# EAGLE schematic babelbabel (EAGLE 9.6.2)

## Sheet 1 of 2
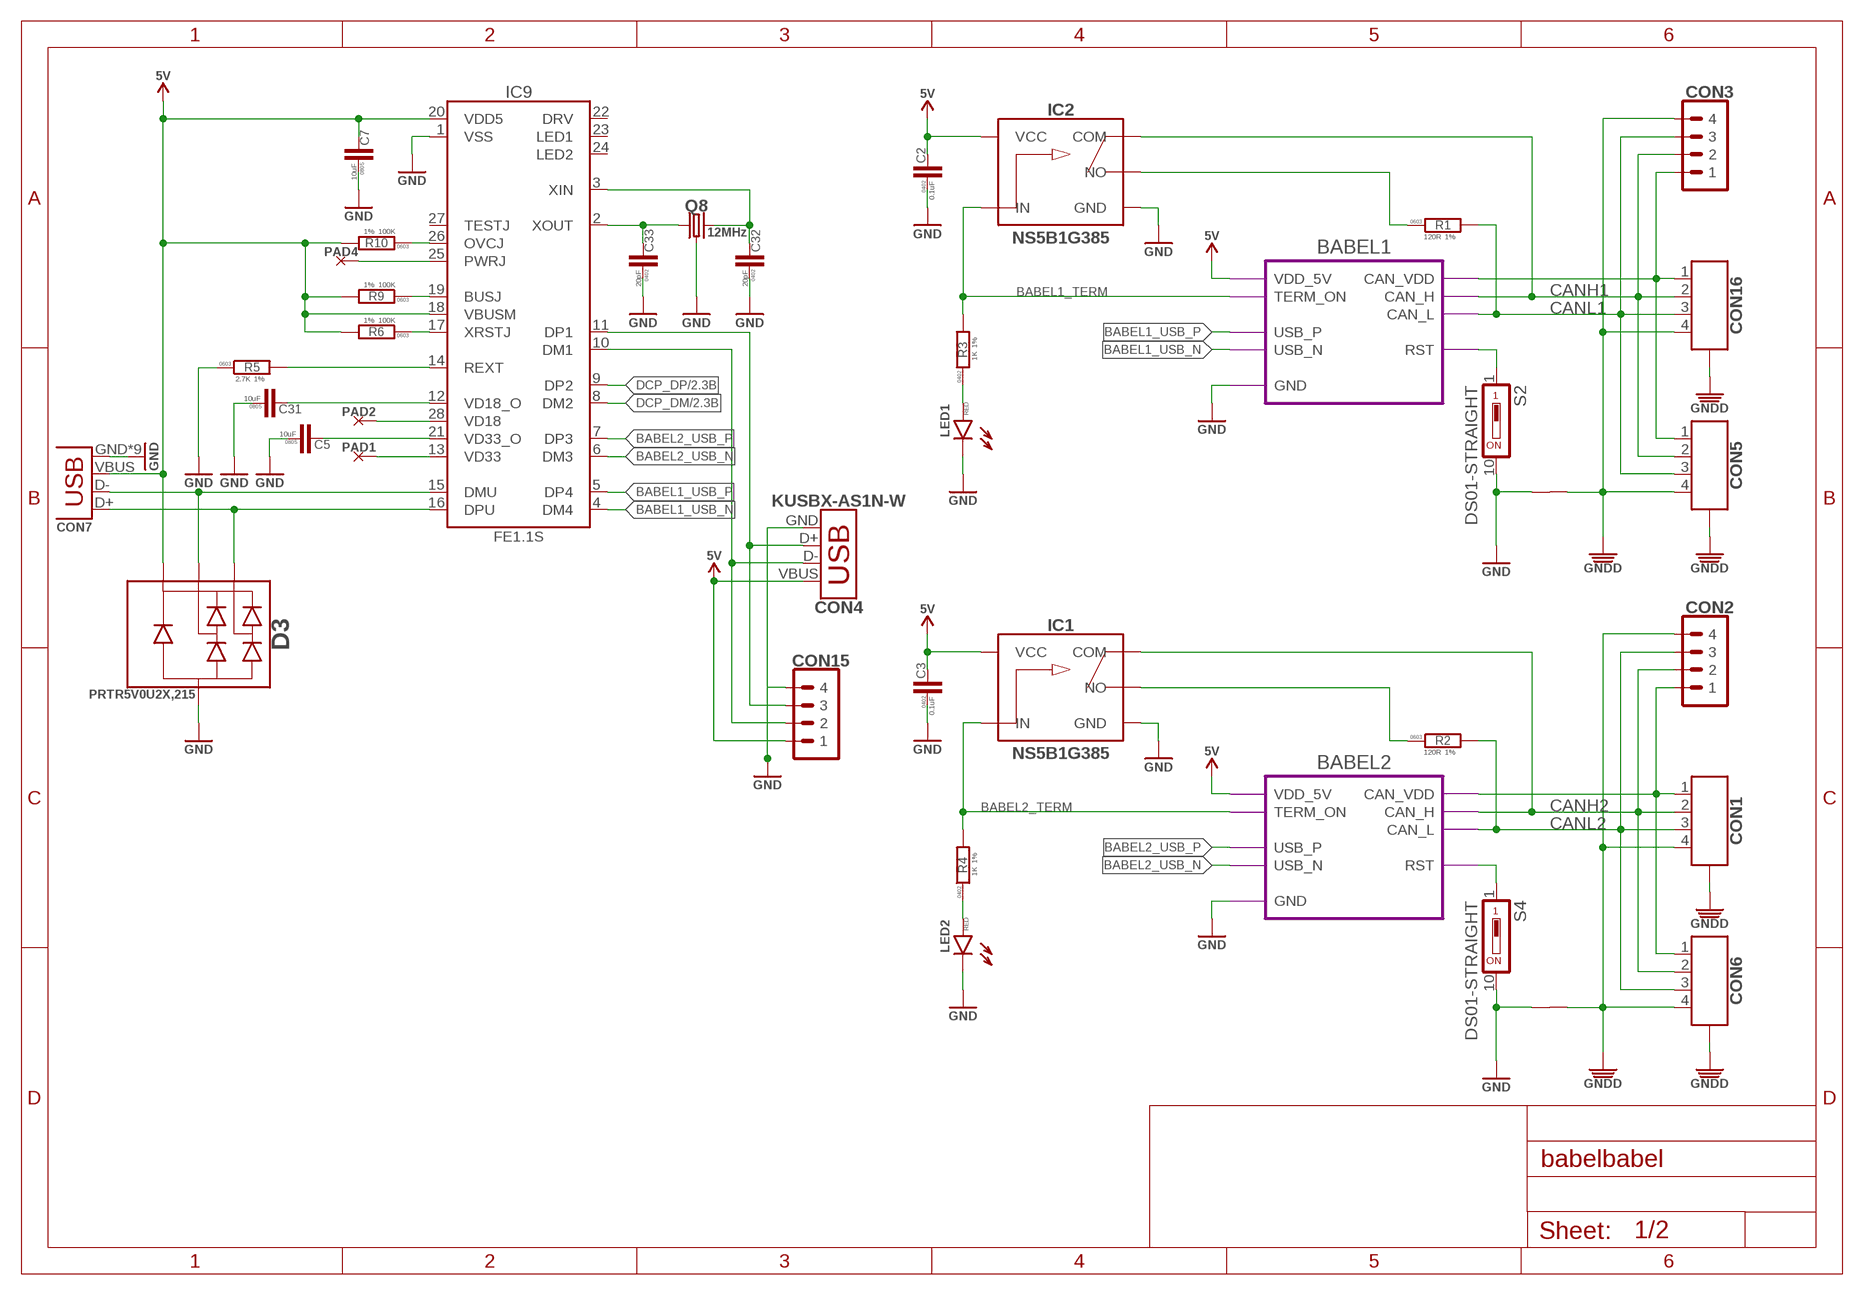
[diagram p0: schematic, sheet 1]

### Parts
C2  0.1uF  C-0402  [C0402]
C3  0.1uF  C-0402  [C0402]
C5  10uF  C-0805  [C0805]
C7  10uF  C-0805  [C0805]
C31  10uF  C-0805  [C0805]
C32  20pF  C-0402  [C0402]
C33  20pF  C-0402  [C0402]
CON1  CON-4P-TABS-JST_GH-RA  [JST_GH-4P-RA]
CON2  PINHEAD_1X04-2.54  [1X04-PTH-2.54]
CON3  PINHEAD_1X04-2.54  [1X04-PTH-2.54]
CON4  USB-AA-PTH  [USB-A-F-PTH]
CON5  CON-4P-TABS-JST_GH-RA  [JST_GH-4P-RA]
CON6  CON-4P-TABS-JST_GH-RA  [JST_GH-4P-RA]
CON7  USB-1  [MICRO_USB_PEGS]
CON15  PINHEAD_1X04-2.54  [1X04-PTH-2.54]
CON16  CON-4P-TABS-JST_GH-RA  [JST_GH-4P-RA]
D3  PRTR5V0U2X  [SOT143B]
IC1  NS5B1G385  [SOT23-5L]
IC2  NS5B1G385  [SOT23-5L]
IC9  FE1.1S  [SSOP-28]
J1  CONNECTION-SMD  [CONNECTION]
J2  CONNECTION-SMD  [CONNECTION]
LED1  LED-0402  [LED0402]
LED2  LED-0402  [LED0402]
PAD1  PAD-S_2X2  [2х2]
PAD2  PAD-S_2X2  [2х2]
PAD4  PAD-S_2X2  [2х2]
Q8  12MHz  CRYSTAL-4P-16MHZ-3.2X2.5  [OSCILLATOR-3.2X2.5-4P]
R1  120R  R-1%-0603  [R0603]
R2  120R  R-1%-0603  [R0603]
R3  1K  R-1%-0402  [R0402]
R4  1K  R-1%-0402  [R0402]
R5  2.7K  R-1%-0603  [R0603]
R6  100K  R-1%-0603  [R0603]
R9  100K  R-1%-0603  [R0603]
R10  100K  R-1%-0603  [R0603]
S2  DS01-STRAIGHT  [DS-01]
S4  DS01-STRAIGHT  [DS-01]

### Module instances
BABEL1 = BABEL (part numbers offset by 100)
BABEL2 = BABEL (part numbers offset by 200)

### Nets
BABEL1_RST: S2.1 ; port BABEL1.RST
BABEL1_RST1: S4.1 ; port BABEL2.RST
BABEL1_TERM: IC2.4(IN) R3.2 ; port BABEL1.TERM_ON
BABEL1_USB_N: IC9.4(DM4) ; port BABEL1.USB_N
BABEL1_USB_P: IC9.5(DP4) ; port BABEL1.USB_P
BABEL2_TERM: IC1.4(IN) R4.2 ; port BABEL2.TERM_ON
BABEL2_USB_N: IC9.6(DM3) ; port BABEL2.USB_N
BABEL2_USB_P: IC9.7(DP3) ; port BABEL2.USB_P
CAN1_VDD: CON3.1 CON5.1 CON16.1 ; port BABEL1.CAN_VDD
CAN1_VDD1: CON1.1 CON2.1 CON6.1 ; port BABEL2.CAN_VDD
CAN_L: IC2.2(NO) R1.1
CANH1: CON3.2 CON5.2 CON16.2 IC2.1(COM) ; port BABEL1.CAN_H
CANH2: CON1.2 CON2.2 CON6.2 IC1.1(COM) ; port BABEL2.CAN_H
CANL1: CON3.3 CON5.3 CON16.3 R1.2 ; port BABEL1.CAN_L
CANL2: CON1.3 CON2.3 CON6.3 R2.2 ; port BABEL2.CAN_L
DCP_DM: IC9.8(DM2) ; also sheet 2
DCP_DP: IC9.9(DP2) ; also sheet 2
DUT_DM: CON4.D- CON15.2 IC9.10(DM1)
DUT_DP: CON4.D+ CON15.3 IC9.11(DP1)
GND: C2.1 C3.1 C5.1 C7.1 C31.1 C32.1 C33.1 CON4.GND CON7.GND CON7.GND1(GND) CON7.GND2(GND) CON7.GND3(GND) CON7.GND4(GND) CON7.P$1(GND) CON7.P$2(GND) CON7.P$3(GND) CON7.P$4(GND) CON15.4 D3.1(C) IC1.3(GND) IC2.3(GND) IC9.1(VSS) J1.P$1 J2.P$1 LED1.C LED2.C Q8.2(GND) Q8.4(GND) R5.1 S2.10 S4.10 ; port BABEL1.GND BABEL2.GND ; also sheet 2
GNDD: CON1.4 CON1.M$0(GND) CON1.M$1(GND) CON2.4 CON3.4 CON5.4 CON5.M$0(GND) CON5.M$1(GND) CON6.4 CON6.M$0(GND) CON6.M$1(GND) CON16.4 CON16.M$0(GND) CON16.M$1(GND) J1.P$2 J2.P$2
N$1: LED1.A R3.1
N$2: IC1.2(NO) R2.1
N$3: LED2.A R4.1
N$9: C31.2 IC9.12(VD18_O)
N$10: IC9.14(REXT) R5.2
N$14: C33.2 IC9.2(XOUT) Q8.1
N$16: C32.2 IC9.3(XIN) Q8.3
N$17: CON7.D+ D3.2(D1) IC9.16(DPU)
N$18: CON7.D- D3.3(D2) IC9.15(DMU)
N$19: IC9.26(OVCJ) R10.1
N$24: C5.2 IC9.21(VD33_O)
N$25: IC9.17(XRSTJ) R6.1
N$26: IC9.19(BUSJ) R9.1
N$27: IC9.25(PWRJ) PAD4.P$1
N$29: IC9.13(VD33) PAD1.P$1
N$30: IC9.28(VD18) PAD2.P$1
VDD_5V: C2.2 C3.2 C7.2 CON4.VBUS CON7.VBUS CON15.1 D3.4(A) IC1.5(VCC) IC2.5(VCC) IC9.18(VBUSM) IC9.20(VDD5) R6.2 R9.2 R10.2 ; port BABEL1.VDD_5V BABEL2.VDD_5V ; supply symbol labelled 5V ; also sheet 2
Unconnected: IC9.22(DRV) IC9.23(LED1) IC9.24(LED2) IC9.27(TESTJ)

## Sheet 2 of 2: DCP
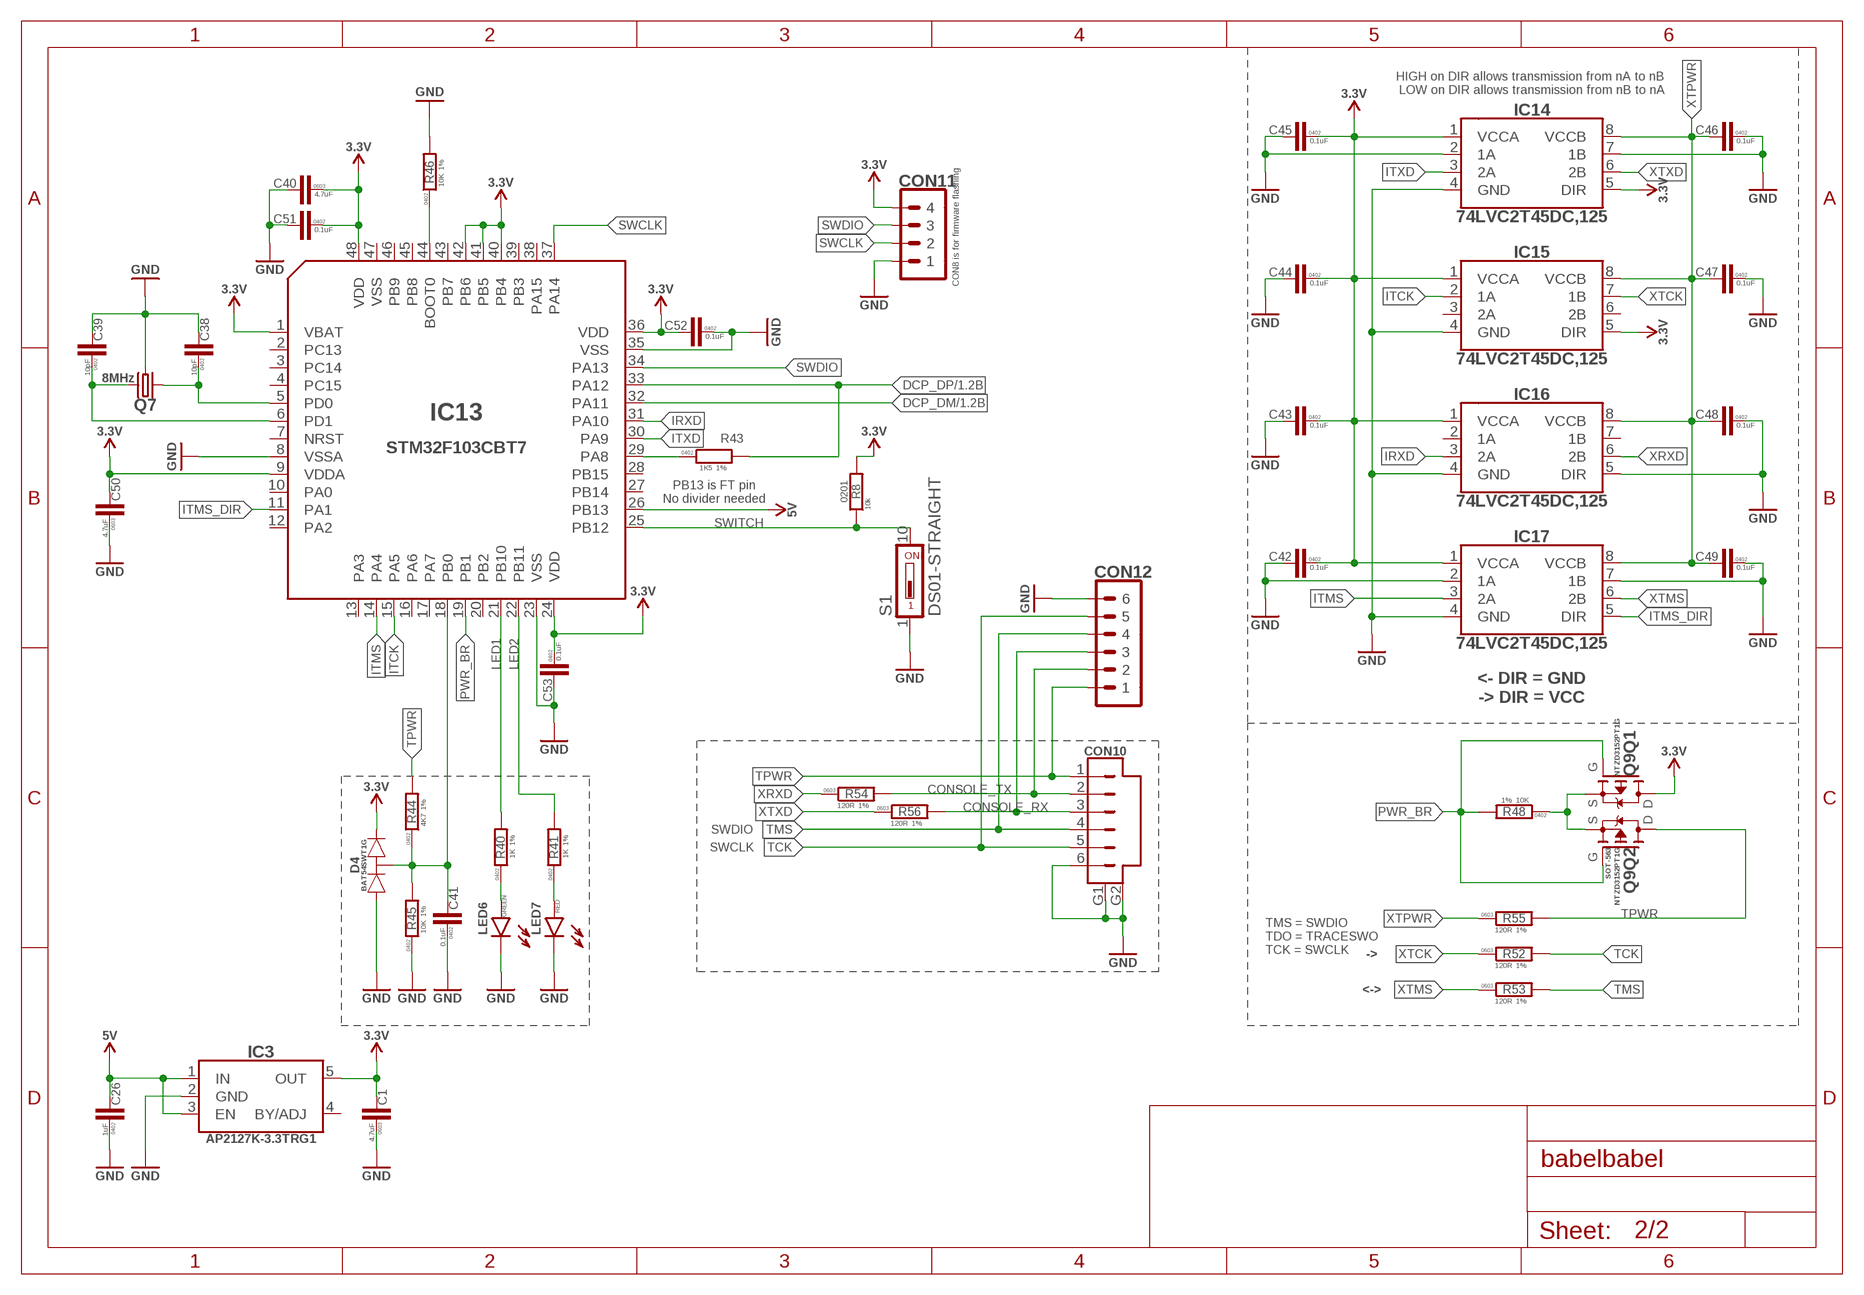
[diagram p1: schematic, sheet 2]

### Parts
C1  4.7uF  C-0603  [C0603]
C26  1uF  C-0402  [C0402]
C38  10pF  C-0402  [C0402]
C39  10pF  C-0402  [C0402]
C40  4.7uF  C-0603  [C0603]
C41  0.1uF  C-0402  [C0402]
C42  0.1uF  C-0402  [C0402]
C43  0.1uF  C-0402  [C0402]
C44  0.1uF  C-0402  [C0402]
C45  0.1uF  C-0402  [C0402]
C46  0.1uF  C-0402  [C0402]
C47  0.1uF  C-0402  [C0402]
C48  0.1uF  C-0402  [C0402]
C49  0.1uF  C-0402  [C0402]
C50  4.7uF  C-0603  [C0603]
C51  0.1uF  C-0402  [C0402]
C52  0.1uF  C-0402  [C0402]
C53  0.1uF  C-0402  [C0402]
CON10  CON-6P-SM06B  [SM06B]
CON11  PINHEAD_1X04-2.54  [1X04-PTH-2.54]
CON12  PINHEAD_1X06-2.54  [1X06-PTH-2.54]
D4  BAT54SWT1G  [SC70]
IC3  AP2127-3.3  [SOT23-5]
IC13  STM32F103CBT7  [LQFP48]
IC14  74LVC2T45  [VSSOP8]
IC15  74LVC2T45  [VSSOP8]
IC16  74LVC2T45  [VSSOP8]
IC17  74LVC2T45  [VSSOP8]
LED6  LED-0402  [LED0402]
LED7  LED-0402  [LED0402]
Q7  8MHz  CRYSTAL-4P-3.2X2.5  [OSCILLATOR-3.2X2.5-4P]
Q9  NTZD3152PT1G  [SOT-563]
R8  10k  R-EU_R0201  [R0201]
R40  1K  R-1%-0402  [R0402]
R41  1K  R-1%-0402  [R0402]
R43  1K5  R-1%-0402  [R0402]
R44  4K7  R-1%-0402  [R0402]
R45  10K  R-1%-0402  [R0402]
R46  10K  R-1%-0402  [R0402]
R48  10K  R-1%-0402  [R0402]
R52  120R  R-1%-0603  [R0603]
R53  120R  R-1%-0603  [R0603]
R54  120R  R-1%-0603  [R0603]
R55  120R  R-1%-0603  [R0603]
R56  120R  R-1%-0603  [R0603]
S1  DS01-STRAIGHT  [DS-01]

### Nets
CONSOLE_RX: CON10.3 CON12.3 R56.2
CONSOLE_TX: CON10.2 CON12.2 R54.2
DCP_DM: IC13.32(PA11) ; also sheet 1
DCP_DP: IC13.33(PA12) R43.2 ; also sheet 1
GND: C1.1 C26.1 C38.2 C39.2 C40.2 C41.1 C42.2 C43.2 C44.2 C45.2 C46.1 C47.1 C48.1 C49.1 C50.1 C51.2 C52.1 C53.2 CON10.6 CON10.G1 CON10.G2 CON11.1 CON12.6 D4.1(A) IC3.2(GND) IC13.8(VSSA) IC13.23(VSS) IC13.35(VSS) IC14.2(1A) IC14.4(GND) IC14.7(1B) IC15.4(GND) IC16.4(GND) IC16.5(DIR) IC17.2(1A) IC17.4(GND) IC17.7(1B) LED6.C LED7.C Q7.2(GND) Q7.4(GND) R45.1 R46.2 S1.1 ; also sheet 1
IRXD: IC13.31(PA10) IC16.3(2A)
ITCK: IC13.15(PA5) IC15.2(1A)
ITMS: IC13.14(PA4) IC17.3(2A)
ITMS_DIR: IC13.11(PA1) IC17.5(DIR)
ITXD: IC13.30(PA9) IC14.3(2A)
LED1: IC13.21(PB10) R40.2
LED2: IC13.22(PB11) R41.2
N$37: C38.1 IC13.5(PD0) Q7.1
N$38: C39.1 IC13.6(PD1) Q7.3
N$39: LED6.A R40.1
N$40: LED7.A R41.1
N$42: IC13.29(PA8) R43.1
N$43: IC13.44(BOOT0) R46.1
N$44: Q9.1(Q2:S) Q9.4(Q1:S) R48.1
PWR_BR: IC13.19(PB1) Q9.2(Q2:G) Q9.5(Q1:G) R48.2
SWCLK: CON11.2 IC13.37(PA14)
SWDIO: CON11.3 IC13.34(PA13)
SWITCH: IC13.25(PB12) R8.1 S1.10
TCK: CON10.5 CON12.5 R52.2
TMS: CON10.4 CON12.4 R53.2
TPWR: CON10.1 CON12.1 Q9.6(Q2:D) R44.2 R55.2
VBUS3: C41.2 D4.3(COMMON) IC13.18(PB0) R44.1 R45.2
VDD_3V3: C1.2 C40.1 C42.1 C43.1 C44.1 C45.1 C50.2 C51.1 C52.2 C53.1 CON11.4 D4.2(C) IC3.5(OUT) IC13.1(VBAT) IC13.9(VDDA) IC13.24(VDD) IC13.36(VDD) IC13.40(PB4) IC13.41(PB5) IC13.42(PB6) IC13.48(VDD) IC14.1(VCCA) IC14.5(DIR) IC15.1(VCCA) IC15.5(DIR) IC16.1(VCCA) IC17.1(VCCA) Q9.3(Q1:D) R8.2 ; supply symbol labelled 3.3V
VDD_5V: C26.2 IC3.1(IN) IC3.3(EN) IC13.26(PB13) ; supply symbol labelled 5V ; also sheet 1
XRXD: IC16.6(2B) R54.1
XTCK: IC15.7(1B) R52.1
XTMS: IC17.6(2B) R53.1
XTPWR: C46.2 C47.2 C48.2 C49.2 IC14.8(VCCB) IC15.8(VCCB) IC16.8(VCCB) IC17.8(VCCB) R55.1
XTXD: IC14.6(2B) R56.1
Unconnected: IC3.4(BY/ADJ) IC13.2(PC13) IC13.3(PC14) IC13.4(PC15) IC13.7(NRST) IC13.10(PA0) IC13.12(PA2) IC13.13(PA3) IC13.16(PA6) IC13.17(PA7) IC13.20(PB2) IC13.27(PB14) IC13.28(PB15) IC13.38(PA15) IC13.39(PB3) IC13.43(PB7) IC13.45(PB8) IC13.46(PB9) IC13.47(VSS) IC15.3(2A) IC15.6(2B) IC16.2(1A) IC16.7(1B)

### Notes on the sheet
- HIGH on DIR allows transmission from nA to nB 
  LOW on DIR allows transmission from nB to nA
- CON8 is for firmware flashing
- PB13 is FT pin
  No divider needed
- <- DIR = GND
  -> DIR = VCC
- SWDIO
- SWCLK
- TMS = SWDIO
  TDO = TRACESWO
  TCK = SWCLK
- ->
- <->

## Library data of the parts
C1 C40 C50 = rc:C; LCSC#: C19666; PACKAGE: 0603
C2 C3 C41-C49 C51-C53 = rc:C; LCSC#: C1525; PACKAGE: 0402
C5 C7 C31 = rc:C; LCSC#: C15850; PACKAGE: 0805
C26 = rc:C; LCSC#: C52923; PACKAGE: 0402
C32 C33 = rc:C; LCSC#: C1554; PACKAGE: 0402
C38 C39 = rc:C; LCSC#: C32949; PACKAGE: 0402
CON1 CON5 CON6 CON16 = Connectors:CON-4P-TABS: Connector Receptacle 4 Position 0.049" (1.25mm) Tin Surface Mount; AEC-Q: ---; DIGIKEY#: 455-1566-1-ND; LCSC#: C189895; MANF: JST Sales America Inc; MANF#: SM04B-GHS-TB(LF)(SN); OPERATING_TEMP: -25°C ~ 85°C
CON2 CON3 CON11 CON15 = pinhead:PINHEAD_1X04
CON4 = Connectors:USB-A: USB-A (USB TYPE-A) Receptacle Connector 4 Position Through Hole, Right Angle; DIGIKEY#: 2092-KUSBX-AS1N-W-ND; MANF: Kycon, Inc.; MANF#: KUSBX-AS1N-W
CON7 = Connectors:USB: Connector Receptacle USB - micro B 2.0 5 Position; DIGIKEY#: 609-4616-1-ND; LCSC#: C132562; MANF: FCI; MANF#: 10118193-0001LF
CON10 = Connectors:CON-6P: CONN HEADER 6 POS; DIGIKEY#: 455-1806-1-ND; LCSC#: C160405; MANF: JST Sales America Inc; MANF#: SM06B-SRSS-TB(LF)(SN)
CON12 = pinhead:PINHEAD_1X06: pinheader 6P
D3 = TVS_diodes:PRTR5V0U2X: DIODES - ESD SOT-143; DIGIKEY#: 568-4140-2-ND; LCSC#: C12333; MANF: NXP USA Inc; MANF#: PRTR5V0U2X,215
D4 = Diodes:BAT54SWT1G: 30V 200mA 800mV @ 100mA SOT-323(SC-70) Schottky Barrier Diodes (SBD) RoHS; LCSC#: C78260; MANF: ON Semiconductor; MANF#: BAT54SWT1G
IC1 IC2 = misc:NS5B1G385: IC ANLG SWITCH SPST NO 5TSOP; DIGIKEY#: 1727-6763-1-ND; LCSC#: C554311; MANF: Nexperia USA Inc.; MANF#: 74AHC1G66GV,125
IC3 = linear regulators:AP2127: IC REG LINEAR 3.3V 300MA SOT23-5; DIGIKEY#: AP2127K-3.3TRG1DITR-ND; I_MAX: 300mA; LCSC#: C156285; MANF: Diodes Incorporated; MANF#: AP2127K-3.3TRG1; V_MAX: 6V
IC9 = misc:FE1.1S: USB 2.0 HIGH SPEED 4-PORT HUB CONTROLLER; LCSC#: C9359; MANF: Terminus Tech; MANF#: FE1.1S
IC13 = stm32:STM32F103CBT7: ARM® Cortex®-M3 STM32F1 Microcontroller IC 32-Bit 72MHz 128KB (128K x 8) FLASH 48-LQFP (7x7); DIGIKEY#: 497-11518-ND; LCSC#: C8304; MANF: STMicroelectronics; MANF#: STM32F103CBT7
IC14-IC17 = misc:74LVC2T45: Voltage Level Translator Bidirectional 1 Circuit 2 Channel 420Mbps; ALTERNATIVE: 74LVC2T45DC-Q100H; DIGIKEY#: 1727-4578-2-ND; LCSC#: C139382; MANF: Nexperia USA Inc; MANF#: 74LVC2T45DC,125
J1 J2 = misc:CONNECTION; BOM: EXCLUDE
LED1 LED2 LED7 = rc:LED: SMD LED; COLOR: RED; LCSC#: C74339
LED6 = rc:LED: SMD LED; COLOR: GREEN; LCSC#: C74338
PAD1 PAD2 PAD4 = PADS:PAD; BOM: EXCLUDE
Q7 = crystal:CRYSTAL-4P: Smd Crystal; LCSC#: C133366; LOAD_CAPACITANCE: 10pF
Q8 = crystal:CRYSTAL-4P: Smd Crystal; LCSC#: C9002; LOAD_CAPACITANCE: 20pF; VALUE: 16MHz
Q9 = mosfet:NTZD3152PT1G: Mosfet Array 2 P-Channel (Dual) 20V 430mA 250mW Surface Mount SOT-563; DIGIKEY#: NTZD3152PT1GOSCT-ND; LCSC#: C393372; MANF: ON Semiconductor; MANF#: NTZD3152PT1G; PACKAGE: SOT-563
R1 R2 R52-R56 = rc:R; LCSC#: C22787; PACKAGE: 0603; TOLERANCE: 1%
R3 R4 R40 R41 = rc:R; LCSC#: C11702; PACKAGE: 0402; TOLERANCE: 1%
R5 = rc:R; LCSC#: C13167; PACKAGE: 0603; TOLERANCE: 1%
R6 R9 R10 = rc:R; LCSC#: C25803; PACKAGE: 0603; TOLERANCE: 1%
R8 = rcl:R-EU_: RESISTOR, European symbol; MANF: YAGEO; MANF#: RC0201FR-0710KL; PACKAGE: 0201; SPICEPREFIX: R
R43 = rc:R; LCSC#: C25867; PACKAGE: 0402; TOLERANCE: 1%
R44 = rc:R; LCSC#: C25900; PACKAGE: 0402; TOLERANCE: 1%
R45 R46 R48 = rc:R; LCSC#: C25744; PACKAGE: 0402; TOLERANCE: 1%
S1 S2 S4 = misc:DS01; LCSC#: C319063; MANF: XKB Connectivity; MANF#: DS-01RP

## Module BABEL
Ports: GND(pwr) USB_N(io) USB_P(io) CAN_H(io) CAN_L(io) RST(in) CAN_VDD(out) VDD_5V(pwr) TERM_ON(io)
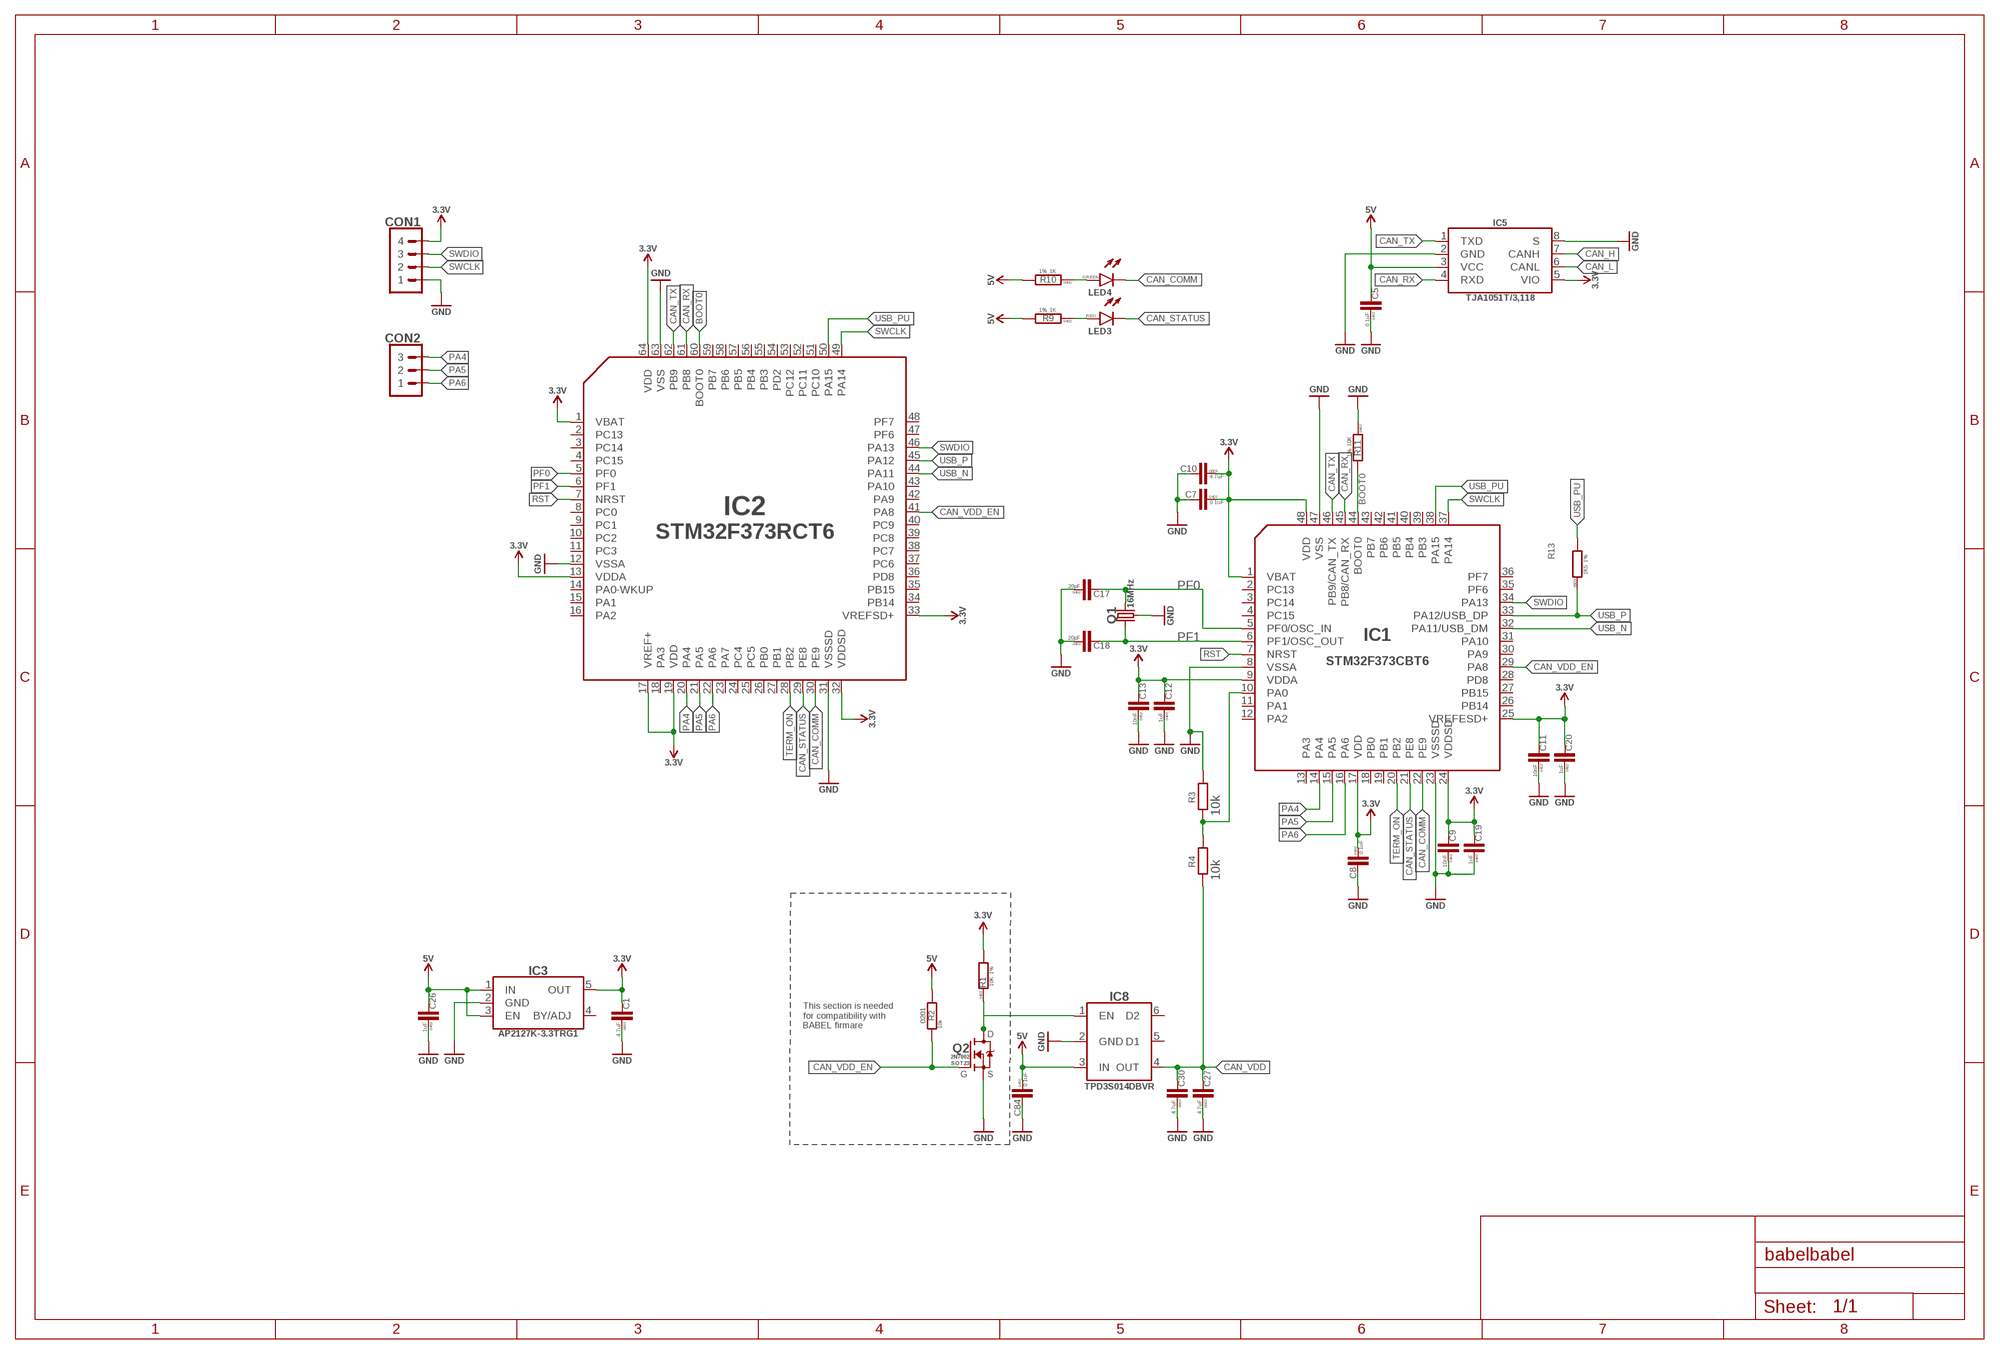
[diagram p2: schematic, module BABEL, sheet 1]

### Parts
C1  4.7uF  C-0603  [C0603]
C5  0.1uF  C-0402  [C0402]
C7  0.1uF  C-0402  [C0402]
C8  0.1uF  C-0402  [C0402]
C9  10nF  C-0402  [C0402]
C10  4.7uF  C-0603  [C0603]
C11  10nF  C-0402  [C0402]
C12  1uF  C-0402  [C0402]
C13  10nF  C-0402  [C0402]
C17  20pF  C-0402  [C0402]
C18  20pF  C-0402  [C0402]
C19  1uF  C-0402  [C0402]
C20  1uF  C-0402  [C0402]
C26  1uF  C-0402  [C0402]
C27  4.7uF  C-0603  [C0603]
C30  4.7uF  C-0603  [C0603]
C84  0.1uF  C-0402  [C0402]
CON1  PINHEAD_1X04-2.54  [1X04-PTH-2.54]  (not fitted in variant 48_pin_MCU)  (not fitted in variant 64_pin_MCU)
CON2  PINHEAD_1X03-2.54  [1X03-PTH-2.54]  (not fitted in variant 48_pin_MCU)  (not fitted in variant 64_pin_MCU)
IC1  STM32F373CBT6-LQFP48  [LQFP48]
IC2  STM32F373RCT6  [TQFP64]  (not fitted in variant 48_pin_MCU)  (not fitted in variant 64_pin_MCU)
IC3  AP2127-3.3  [SOT23-5]
IC5  TJA1051-SO8  [SOIC8]
IC8  TPD3S014DBVR-SOT23-6  [SOT26]
LED3  LED-0402  [LED0402]
LED4  LED-0402  [LED0402]
Q1  16MHz  CRYSTAL-4P-3.2X2.5  [OSCILLATOR-3.2X2.5-4P]
Q2  2N7002  [SOT23]
R1  10K  R-1%-0402  [R0402]
R2  10k  R-EU_R0201  [R0201]
R3  10k  R-EU_R0402  [R0402]
R4  10k  R-EU_R0402  [R0402]
R9  1K  R-1%-0402  [R0402]
R10  1K  R-1%-0402  [R0402]
R11  10K  R-1%-0402  [R0402]
R13  1K5  R-1%-0603  [R0603]

### Nets
BOOT0: IC1.44(BOOT0) IC2.60(BOOT0) R11.2
CAN_COMM: IC1.22(PE9) IC2.30(PE9) LED4.C
CAN_H: IC5.7(CANH)
CAN_L: IC5.6(CANL)
CAN_RX: IC1.45(PB8/CAN_RX) IC2.61(PB8) IC5.4(RXD)
CAN_STATUS: IC1.21(PE8) IC2.29(PE8) LED3.C
CAN_TX: IC1.46(PB9/CAN_TX) IC2.62(PB9) IC5.1(TXD)
CAN_VDD: C27.2 C30.2 IC8.4(OUT) R4.1
CAN_VDD_EN: IC1.29(PA8) IC2.41(PA8) Q2.1(G) R2.1
GND: C1.1 C5.1 C7.2 C8.2 C9.1 C10.2 C11.1 C12.1 C13.1 C17.1 C18.1 C19.1 C20.1 C26.1 C27.1 C30.1 C84.2 CON1.1 IC1.8(VSSA) IC1.23(VSSSD) IC1.47(VSS) IC2.12(VSSA) IC2.31(VSSSD) IC2.63(VSS) IC3.2(GND) IC5.2(GND) IC5.8(S) IC8.2(GND) Q1.2(GND) Q1.4(GND) Q2.2(S) R3.2 R11.1
N$1: IC8.1(EN) Q2.3(D) R1.1
N$4: IC1.10(PA0) R3.1 R4.2
N$27: LED3.A R9.1
N$28: LED4.A R10.1
PA4: CON2.3 IC1.14(PA4) IC2.20(PA4)
PA5: CON2.2 IC1.15(PA5) IC2.21(PA5)
PA6: CON2.1 IC1.16(PA6) IC2.22(PA6)
PF0: C17.2 IC1.5(PF0/OSC_IN) IC2.5(PF0) Q1.3
PF1: C18.2 IC1.6(PF1/OSC_OUT) IC2.6(PF1) Q1.1
RST: IC1.7(NRST) IC2.7(NRST)
SWCLK: CON1.2 IC1.37(PA14) IC2.49(PA14)
SWDIO: CON1.3 IC1.34(PA13) IC2.46(PA13)
TERM_ON: IC1.20(PB2) IC2.28(PB2)
USB_N [usb]: IC1.32(PA11/USB_DM) IC2.44(PA11)
USB_P: IC1.33(PA12/USB_DP) IC2.45(PA12) R13.1
USB_PU: IC1.38(PA15) IC2.50(PA15) R13.2
VDD_3V3: C1.2 C7.1 C8.1 C9.2 C10.1 C11.2 C12.2 C13.2 C19.2 C20.2 CON1.4 IC1.1(VBAT) IC1.9(VDDA) IC1.17(VDD) IC1.24(VDDSD) IC1.25(VREFESD+) IC1.48(VDD) IC2.1(VBAT) IC2.13(VDDA) IC2.17(VREF+) IC2.19(VDD) IC2.32(VDDSD) IC2.33(VREFSD+) IC2.64(VDD) IC3.5(OUT) IC5.5(VIO) R1.2 ; supply symbol labelled 3.3V
VDD_5V: C5.2 C26.2 C84.1 IC3.1(IN) IC3.3(EN) IC5.3(VCC) IC8.3(IN) R2.2 R9.2 R10.2 ; supply symbol labelled 5V
Unconnected: IC1.2(PC13) IC1.3(PC14) IC1.4(PC15) IC1.11(PA1) IC1.12(PA2) IC1.13(PA3) IC1.18(PB0) IC1.19(PB1) IC1.26(PB14) IC1.27(PB15) IC1.28(PD8) IC1.30(PA9) IC1.31(PA10) IC1.35(PF6) IC1.36(PF7) IC1.39(PB3) IC1.40(PB4) IC1.41(PB5) IC1.42(PB6) IC1.43(PB7) IC2.2(PC13) IC2.3(PC14) IC2.4(PC15) IC2.8(PC0) IC2.9(PC1) IC2.10(PC2) IC2.11(PC3) IC2.14(PA0-WKUP) IC2.15(PA1) IC2.16(PA2) IC2.18(PA3) IC2.23(PA7) IC2.24(PC4) IC2.25(PC5) IC2.26(PB0) IC2.27(PB1) IC2.34(PB14) IC2.35(PB15) IC2.36(PD8) IC2.37(PC6) IC2.38(PC7) IC2.39(PC8) IC2.40(PC9) IC2.42(PA9) IC2.43(PA10) IC2.47(PF6) IC2.48(PF7) IC2.51(PC10) IC2.52(PC11) IC2.53(PC12) IC2.54(PD2) IC2.55(PB3) IC2.56(PB4) IC2.57(PB5) IC2.58(PB6) IC2.59(PB7) IC3.4(BY/ADJ) IC8.5(D1) IC8.6(D2)

### Notes on the sheet
- This section is needed 
  for compatibility with 
  BABEL firmare

### Library data of the parts
C1 C10 C27 C30 = rc:C; LCSC#: C19666; PACKAGE: 0603
C5 C7 C8 C84 = rc:C; LCSC#: C1525; PACKAGE: 0402
C9 C11 C13 = rc:C; LCSC#: C15195; PACKAGE: 0402
C12 C19 C20 C26 = rc:C; LCSC#: C52923; PACKAGE: 0402
C17 C18 = rc:C; LCSC#: C1554; PACKAGE: 0402
CON1 = pinhead:PINHEAD_1X04
CON2 = pinhead:PINHEAD_1X03: pinheader 3P
IC1 = stm32:STM32F373CBT6: IC MCU 32BIT 128KB FLASH 48LQFP; DIGIKEY#: 497-13309-ND; MANF: STMicroelectronics; MANF#: STM32F373CBT6
IC2 = stm32:STM32F373RCT6: 32-Bit FLASH ARM® Cortex®-M4 72MHz 2V ~ 3.6V LQFP-64_10x10x05P ST Microelectronics RoHS; DIGIKEY#: 497-13252-ND; LCSC#: C84174; MANF: STMicroelectronics; MANF#: STM32F373RCT6
IC3 = linear regulators:AP2127: IC REG LINEAR 3.3V 300MA SOT23-5; DIGIKEY#: AP2127K-3.3TRG1DITR-ND; I_MAX: 300mA; LCSC#: C156285; MANF: Diodes Incorporated; MANF#: AP2127K-3.3TRG1; V_MAX: 6V
IC5 = serial_interfaces:TJA1051: 1/1 Transceiver Half CAN; DIGIKEY#: 568-8684-2-ND; LCSC#: C38695; MANF: NXP USA Inc; MANF#: TJA1051T/3,118
IC8 = misc:TPD3S014DBVR: Current Switch Regulator High-Side 500mA SOT-23-6; DIGIKEY#: 296-38835-1-ND; LCSC#: C87384; MANF: Texas Instruments; MANF#: TPD3S014DBVR
LED3 = rc:LED: SMD LED; COLOR: RED; LCSC#: C74339
LED4 = rc:LED: SMD LED; COLOR: GREEN; LCSC#: C74338
Q1 = crystal:CRYSTAL-4P: Smd Crystal; LCSC#: C164049; LOAD_CAPACITANCE: 20pF
Q2 = mosfet:2N7002: N-Channel 60V 115mA 2.5V @ 250uA 7.5Ω @ 500mA,10V 200mW SOT-23(SOT-23-3) MOSFET RoHS; LCSC#: C8545; MANF: Changjiang Electronics Tech (CJ); MANF#: 2N7002; PACKAGE: SOT23
R1 R11 = rc:R; LCSC#: C25744; PACKAGE: 0402; TOLERANCE: 1%
R2 = rcl:R-EU_: RESISTOR, European symbol; MANF: YAGEO; MANF#: RC0201FR-0710KL; PACKAGE: 0201; SPICEPREFIX: R
R3 R4 = rcl:R-EU_: RESISTOR, European symbol; MANF: YAGEO; MANF#: RP0402FRE0710KL; PACKAGE: 0402; SPICEPREFIX: R
R9 R10 = rc:R; LCSC#: C11702; PACKAGE: 0402; TOLERANCE: 1%
R13 = rc:R; MANF: Panasonic; MANF#: ERJ-3EKF1501V; PACKAGE: 0603; TOLERANCE: 1%

## Net classes
1 usb: width 0.2 mm, drill 0.3 mm, clearance 0.2 mm